# Altium project GPSR_v3.PrjPcb
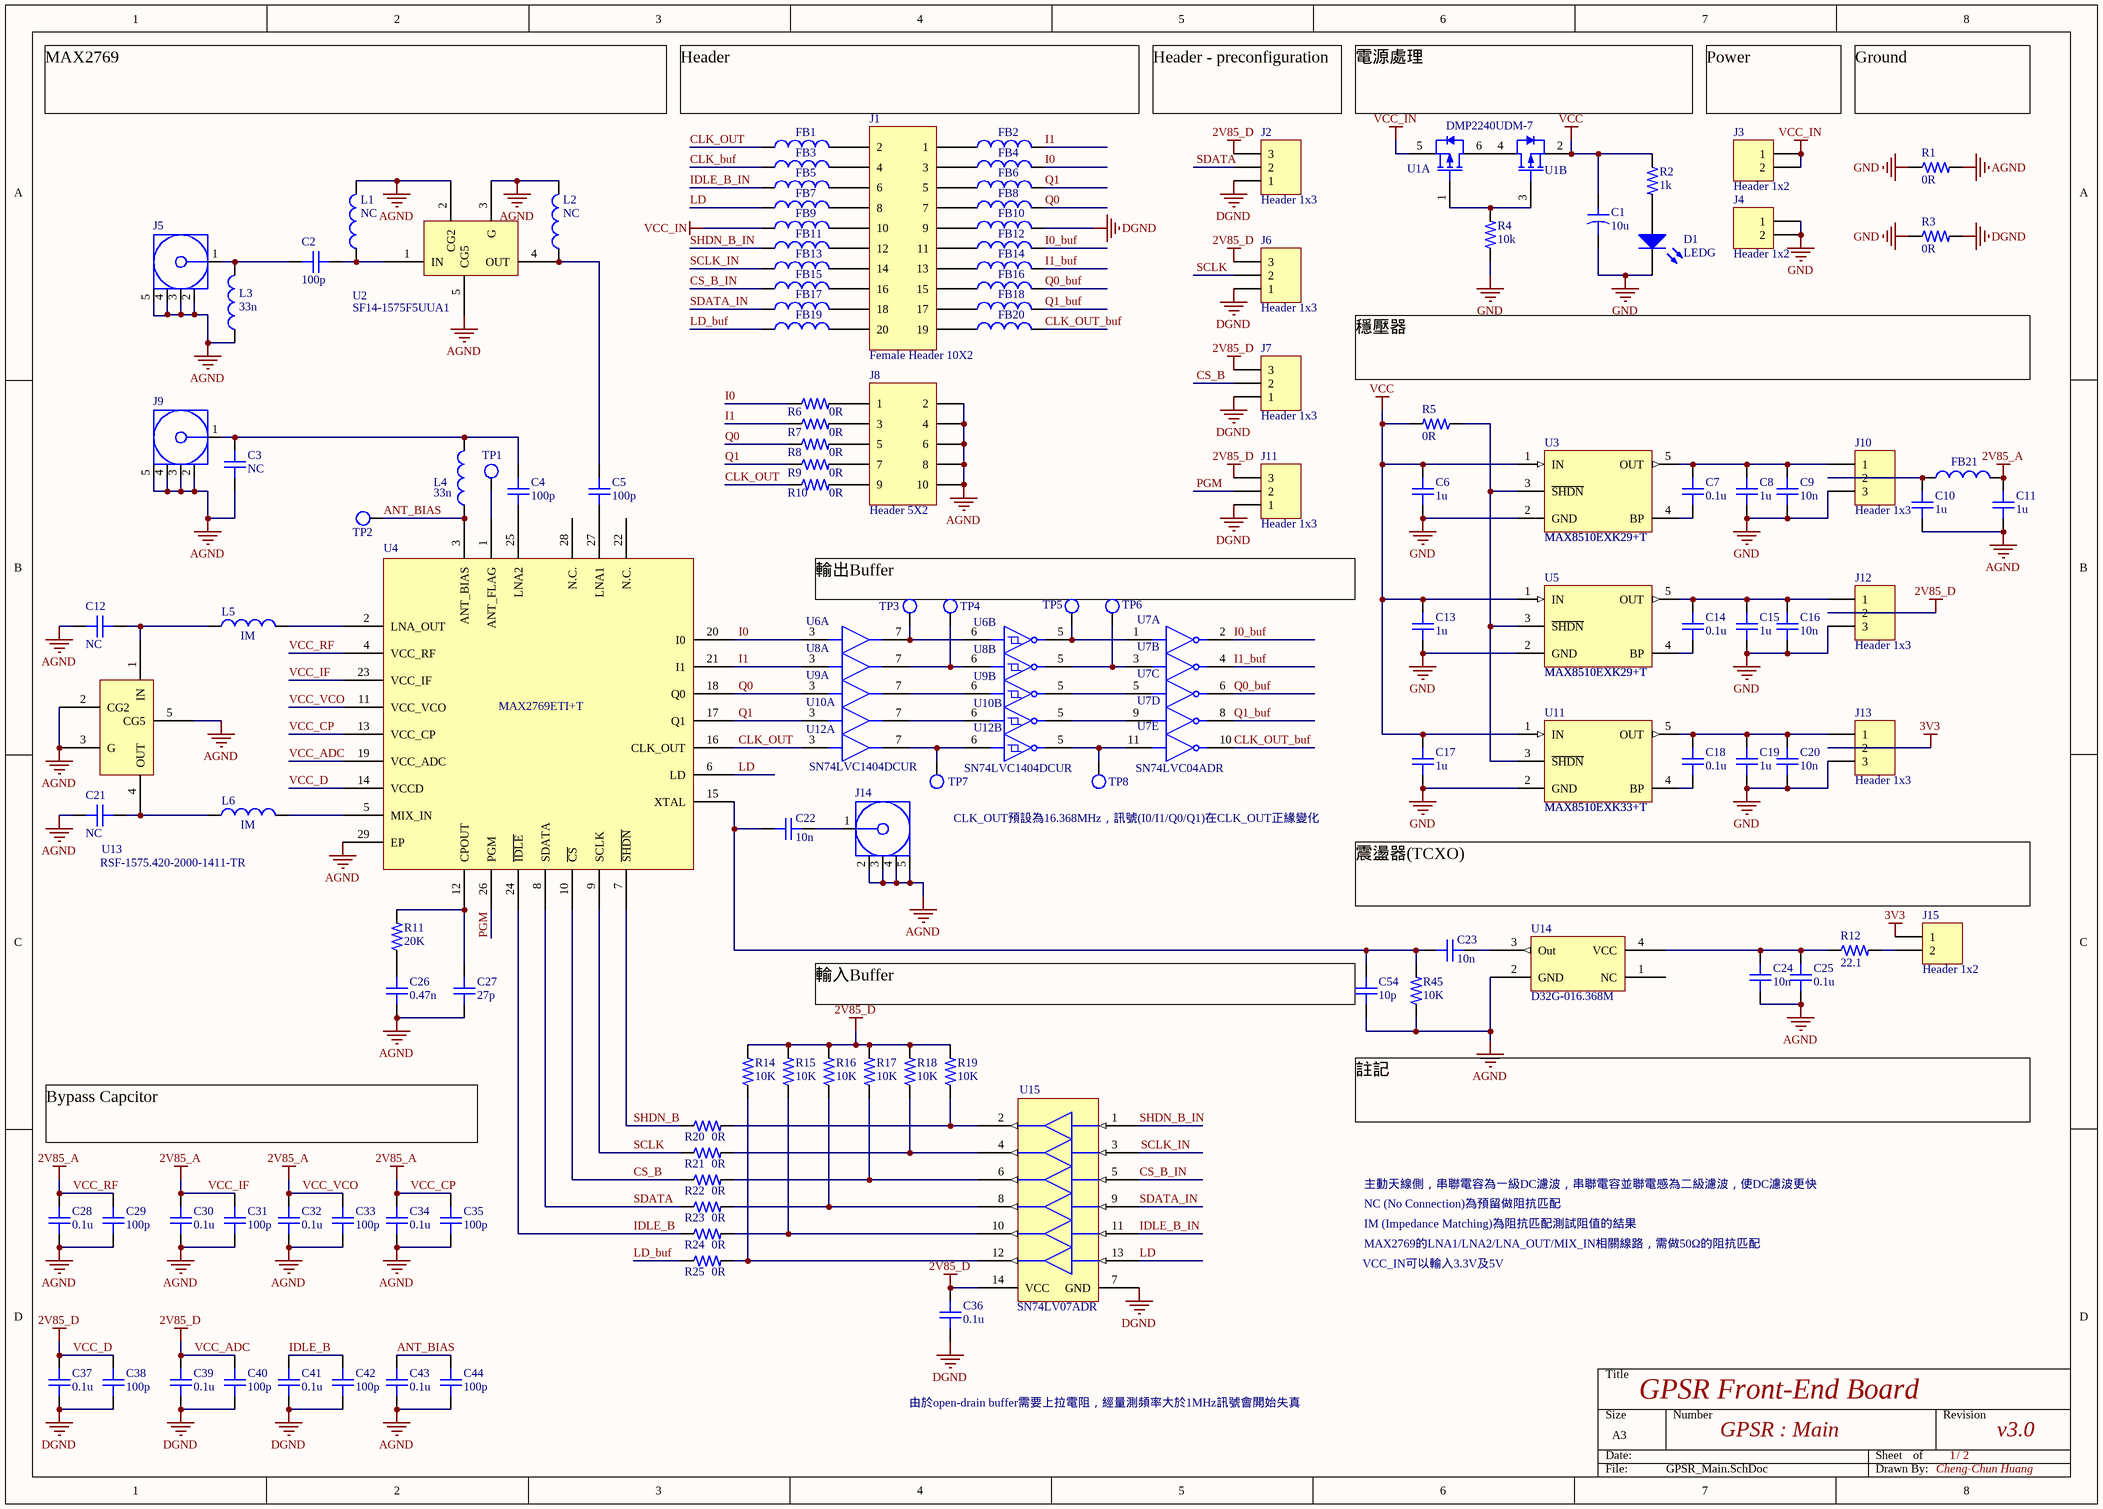
[diagram p0: GPSR_Main.SchDoc]
2 sheets, 185 parts. Net scope: global (net labels, ports and power ports of the same name join across sheets).
Board file: GPSR_v3.PcbDoc
Sheets:
  GPSR_Main.SchDoc
  GPSR_Peripheral.SchDoc

## Sheet GPSR_Main.SchDoc: GPSR Front-End Board
size A3; CompanyName: NYCU; DocumentNumber: GPSR : Main; Revision: v3.0; SheetNumber: 1; SheetTotal: 2; RevisionBy: Cheng-Chun Huang

### Parts
C1  value 10u  [CAPPM6032X280N]  (hidden comment: 10uF)
C2  value 100p  [C0402]  (hidden comment: 100pF)
C3  value NC  [C0402]  (hidden comment: No Connection)
C4  value 100p  [C0402]  (hidden comment: 100pF)
C5  value 100p  [C0402]  (hidden comment: 100pF)
C6  value 1u  [C0402]  (hidden comment: 1uF)
C7  value 0.1u  [C0402]  (hidden comment: 0.1uF)
C8  value 1u  [C0402]  (hidden comment: 1uF)
C9  value 10n  [C0402]  (hidden comment: 10nF)
C10  value 1u  [C0402]  (hidden comment: 1uF)
C11  value 1u  [C0402]  (hidden comment: 1uF)
C12  value NC  [C0402]  (hidden comment: No Connection)
C13  value 1u  [C0402]  (hidden comment: 1uF)
C14  value 0.1u  [C0402]  (hidden comment: 0.1uF)
C15  value 1u  [C0402]  (hidden comment: 1uF)
C16  value 10n  [C0402]  (hidden comment: 10nF)
C17  value 1u  [C0402]  (hidden comment: 1uF)
C18  value 0.1u  [C0402]  (hidden comment: 0.1uF)
C19  value 1u  [C0402]  (hidden comment: 1uF)
C20  value 10n  [C0402]  (hidden comment: 10nF)
C21  value NC  [C0402]  (hidden comment: No Connection)
C22  value 10n  [C0402]  (hidden comment: 10nF)
C23  value 10n  [C0402]  (hidden comment: 10nF)
C24  value 10n  [C0402]  (hidden comment: 10nF)
C25  value 0.1u  [C0402]  (hidden comment: 0.1uF)
C26  value 0.47n  [C0402]  (hidden comment: 0.47nF)
C27  value 27p  [C0402]  (hidden comment: 27pF)
C28  value 0.1u  [C0402]  (hidden comment: 0.1uF)
C29  value 100p  [C0402]  (hidden comment: 100pF)
C30  value 0.1u  [C0402]  (hidden comment: 0.1uF)
C31  value 100p  [C0402]  (hidden comment: 100pF)
C32  value 0.1u  [C0402]  (hidden comment: 0.1uF)
C33  value 100p  [C0402]  (hidden comment: 100pF)
C34  value 0.1u  [C0402]  (hidden comment: 0.1uF)
C35  value 100p  [C0402]  (hidden comment: 100pF)
C36  value 0.1u  [C0603]  (hidden comment: 0.1uF)
C37  value 0.1u  [C0402]  (hidden comment: 0.1uF)
C38  value 100p  [C0402]  (hidden comment: 100pF)
C39  value 0.1u  [C0402]  (hidden comment: 0.1uF)
C40  value 100p  [C0402]  (hidden comment: 100pF)
C41  value 0.1u  [C0402]  (hidden comment: 0.1uF)
C42  value 100p  [C0402]  (hidden comment: 100pF)
C43  value 0.1u  [C0402]  (hidden comment: 0.1uF)
C44  value 100p  [C0402]  (hidden comment: 100pF)
C54  value 10p  [C0402]  (hidden comment: 10pF)
D1  value LEDG  [D0603]  (hidden comment: D0603_LEDG)
FB1  FB0402_signal  [FB0402]  (value not drawn)
FB2  FB0402_signal  [FB0402]  (value not drawn)
FB3  FB0402_signal  [FB0402]  (value not drawn)
FB4  FB0402_signal  [FB0402]  (value not drawn)
FB5  FB0402_signal  [FB0402]  (value not drawn)
FB6  FB0402_signal  [FB0402]  (value not drawn)
FB7  FB0402_signal  [FB0402]  (value not drawn)
FB8  FB0402_signal  [FB0402]  (value not drawn)
FB9  FB0402_signal  [FB0402]  (value not drawn)
FB10  FB0402_signal  [FB0402]  (value not drawn)
FB11  FB0402_signal  [FB0402]  (value not drawn)
FB12  FB0402_signal  [FB0402]  (value not drawn)
FB13  FB0402_signal  [FB0402]  (value not drawn)
FB14  FB0402_signal  [FB0402]  (value not drawn)
FB15  FB0402_signal  [FB0402]  (value not drawn)
FB16  FB0402_signal  [FB0402]  (value not drawn)
FB17  FB0402_signal  [FB0402]  (value not drawn)
FB18  FB0402_signal  [FB0402]  (value not drawn)
FB19  FB0402_signal  [FB0402]  (value not drawn)
FB20  FB0402_signal  [FB0402]  (value not drawn)
FB21  FB0402_pwr  [FB0402]  (value not drawn)
J1  Female Header 10X2  [HDR2X10]
J2  Header 1x3  [HDR1X3]
J3  Header 1x2  [HDR1X2]
J4  Header 1x2  [HDR1X2]
J5  SMA Connector  [SMA-JACK]  (value not drawn)
J6  Header 1x3  [HDR1X3]
J7  Header 1x3  [HDR1X3]
J8  Header 5X2  [HDR2X5]
J9  SMA Connector  [SMA-JACK]  (value not drawn)
J10  Header 1x3  [HDR1X3]
J11  Header 1x3  [HDR1X3]
J12  Header 1x3  [HDR1X3]
J13  Header 1x3  [HDR1X3]
J14  SMA Connector  [SMA-JACK]  (value not drawn)
J15  Header 1x2  [HDR1X2]
L1  value NC  [L0402]  (hidden comment: No Connection)
L2  value NC  [L0402]  (hidden comment: No Connection)
L3  value 33n  [L0402]  (hidden comment: 33nH)
L4  value 33n  [L0402]  (hidden comment: 33nH)
L5  value IM  [L0402]  (hidden comment: Impedance Matching)
L6  value IM  [L0402]  (hidden comment: Impedance Matching)
R1  value 0R  [R0805]  (hidden comment: 0Ω)
R2  value 1k  [R0603]  (hidden comment: 1kΩ)
R3  value 0R  [R0805]  (hidden comment: 0Ω)
R4  value 10k  [R0805]  (hidden comment: 10kΩ)
R5  value 0R  [R0805]  (hidden comment: 0Ω)
R6  value 0R  [R0805]  (hidden comment: 0Ω)
R7  value 0R  [R0805]  (hidden comment: 0Ω)
R8  value 0R  [R0805]  (hidden comment: 0Ω)
R9  value 0R  [R0805]  (hidden comment: 0Ω)
R10  value 0R  [R0805]  (hidden comment: 0Ω)
R11  value 20K  [R0402]  (hidden comment: 20kΩ)
R12  value 22.1  [R0402]  (hidden comment: 22.1Ω)
R14  value 10K  [R0402]  (hidden comment: 10kΩ)
R15  value 10K  [R0402]  (hidden comment: 10kΩ)
R16  value 10K  [R0402]  (hidden comment: 10kΩ)
R17  value 10K  [R0402]  (hidden comment: 10kΩ)
R18  value 10K  [R0402]  (hidden comment: 10kΩ)
R19  value 10K  [R0402]  (hidden comment: 10kΩ)
R20  value 0R  [R0805]  (hidden comment: 0Ω)
R21  value 0R  [R0805]  (hidden comment: 0Ω)
R22  value 0R  [R0805]  (hidden comment: 0Ω)
R23  value 0R  [R0805]  (hidden comment: 0Ω)
R24  value 0R  [R0805]  (hidden comment: 0Ω)
R25  value 0R  [R0805]  (hidden comment: 0Ω)
R45  value 10K  [R0402]  (hidden comment: 10kΩ)
TP1  5006  [5115]  (value not drawn)
TP2  5006  [5115]  (value not drawn)
TP3  5006  [5115]  (value not drawn)
TP4  5006  [5115]  (value not drawn)
TP5  5006  [5115]  (value not drawn)
TP6  5006  [5115]  (value not drawn)
TP7  5006  [5115]  (value not drawn)
TP8  5006  [5115]  (value not drawn)
U1  DMP2240UDM-7  [SOT95P285X140-6N]  (parts A,B of 2)
U2  SF14-1575F5UUA1  [5-SMD]
U3  MAX8510EXK29+T  [SOT65P210X110-5N]
U4  MAX2769ETI+T  [QFN50P500X500X80-29N]  (value not drawn)
U5  MAX8510EXK29+T  [SOT65P210X110-5N]
U6  SN74LVC1404DCUR  [SOP50P310X90-8N]  (value not drawn)  (parts A,B of 4)
U7  SN74LVC04ADR  [SOIC127P600X175-14N]  (value not drawn)  (parts A,B,C,D,E of 7)
U8  SN74LVC1404DCUR  [SOP50P310X90-8N]  (value not drawn)  (parts A,B of 4)
U9  SN74LVC1404DCUR  [SOP50P310X90-8N]  (value not drawn)  (parts A,B of 4)
U10  SN74LVC1404DCUR  [SOP50P310X90-8N]  (value not drawn)  (parts A,B of 4)
U11  MAX8510EXK33+T  [SOT65P210X110-5N]
U12  SN74LVC1404DCUR  [SOP50P310X90-8N]  (parts A,B of 4)
U13  RSF-1575.420-2000-1411-TR  [5-SMD]
U14  D32G-016.368M  [OSC-3225-D32G]
U15  SN74LV07ADR  [SOIC127P600X175-14N]

### Nets
3V3: J13.2 J15.1
AGND: C3.1 C10.1 C11.1 C12.2 C21.2 C24.1 C25.1 C26.1 C27.1 C28.1 C29.1 C30.1 C31.1 C32.1 C33.1 C34.1 C35.1 C43.1 C44.1 C54.1 J5.2(GND) J5.3(GND) J5.4(GND) J5.5(GND) J8.2 J8.4 J8.6 J8.8 J8.10 J9.2(GND) J9.3(GND) J9.4(GND) J9.5(GND) J14.2(GND) J14.3(GND) J14.4(GND) J14.5(GND) L1.2 L2.2 L3.1 R1.2 R45.1 U2.2(CG2) U2.3(G) U2.5(CG5) U4.29(EP) U13.2(CG2) U13.3(G) U13.5(CG5) U14.2(GND)
DGND: C36.2 C37.1 C38.1 C39.1 C40.1 C41.1 C42.1 FB10.2 J2.1 J6.1 J7.1 J11.1 R3.2 U15.7(GND)
GND: C1.2 C6.1 C8.1 C9.1 C13.1 C15.1 C16.1 C17.1 C19.1 C20.1 D1.2(K) J4.1 J4.2 J10.3 J12.3 J13.3 R1.1 R3.1 R4.1 U3.2(GND) U5.2(GND) U11.2(GND)
VCC: C1.1 C6.2 C13.2 C17.2 R2.1 R5.2 U1.2(S2) U3.1(IN) U5.1(IN) U11.1(IN)
VCC_ADC: C36.1 C37.2 C38.2 C39.2 C40.2 J2.3 J6.3 J7.3 J11.3 J12.2 R14.2 R15.2 R16.2 R17.2 R18.2 R19.2 U4.14(VCCD) U4.19(VCC_ADC) U15.14(VCC)  [also labelled 2V85_D, VCC_D]
VCC_CP: C11.2 C28.2 C29.2 C30.2 C31.2 C32.2 C33.2 C34.2 C35.2 FB21.2 U4.4(VCC_RF) U4.11(VCC_VCO) U4.13(VCC_CP) U4.23(VCC_IF)  [also labelled 2V85_A, VCC_IF, VCC_RF, VCC_VCO]
VCC_IN: FB9.1 J3.1 J3.2 U1.5(S1)
ANT_BIAS: C43.2 C44.2 L4.1 TP2.1 U4.3(ANT_BIAS)
CLK_buf: FB3.1
CLK_OUT: FB1.1 R10.1 U4.16(CLK_OUT) U12.3(XIN)
CLK_OUT_buf: FB20.2 U7.10(5Y)
CS_B: J7.2 R22.1 U4.10(~{CS})
CS_B_IN: FB15.1 U15.5(3A)
I0: FB4.2 R6.1 U4.20(I0) U6.3(XIN)
I0_buf: FB12.2 U7.2(1Y)
I1: FB2.2 R7.1 U4.21(I1) U8.3(XIN)
I1_buf: FB14.2 U7.4(2Y)
IDLE_B: C41.2 C42.2 R24.1 U4.24(~{IDLE})
IDLE_B_IN: FB5.1 U15.11(5A)
LD: FB7.1 U4.6(LD) U15.13(6A)
LD_buf: FB19.1 R25.1
PGM: J11.2 U4.26(PGM)
Q0: FB8.2 R8.1 U4.18(Q0) U9.3(XIN)
Q0_buf: FB16.2 U7.6(3Y)
Q1: FB6.2 R9.1 U4.17(Q1) U10.3(XIN)
Q1_buf: FB18.2 U7.8(4Y)
SCLK: J6.2 R21.1 U4.9(SCLK)
SCLK_IN: FB13.1 U15.3(2A)
SDATA: J2.2 R23.1 U4.8(SDATA)
SDATA_IN: FB17.1 U15.9(4A)
SHDN_B: R20.1 U4.7(~{SHDN})
SHDN_B_IN: FB11.1 U15.1(1A)
NetC2_1: C2.1 J5.1(Signal) L3.2
NetC2_2: C2.2 L1.1 U2.1(IN)
NetC3_2: C3.2 C4.2 J9.1(Signal) L4.2
NetC4_1: C4.1 U4.25(LNA2)
NetC5_1: C5.1 U4.27(LNA1)
NetC5_2: C5.2 L2.1 U2.4(OUT)
NetC7_1: C7.1 U3.4(BP)
NetC7_2: C7.2 C8.2 C9.2 J10.1 U3.5(OUT)
NetC10_2: C10.2 FB21.1 J10.2
NetC12_1: C12.1 L5.1 U13.1(IN)
NetC14_1: C14.1 U5.4(BP)
NetC14_2: C14.2 C15.2 C16.2 J12.1 U5.5(OUT)
NetC18_1: C18.1 U11.4(BP)
NetC18_2: C18.2 C19.2 C20.2 J13.1 U11.5(OUT)
NetC21_1: C21.1 L6.1 U13.4(OUT)
NetC22_1: C22.1 C23.1 C54.2 R45.2 U4.15(XTAL)
NetC22_2: C22.2 J14.1(Signal)
NetC23_2: C23.2 U14.3(Out)
NetC24_2: C24.2 C25.2 R12.1 U14.4(VCC)
NetC26_2: C26.2 R11.1
NetC27_2: C27.2 R11.2 U4.12(CPOUT)
NetD1_1: D1.1(A) R2.2
NetFB1_2: FB1.2 J1.2
NetFB2_1: FB2.1 J1.1
NetFB3_2: FB3.2 J1.4
NetFB4_1: FB4.1 J1.3
NetFB5_2: FB5.2 J1.6
NetFB6_1: FB6.1 J1.5
NetFB7_2: FB7.2 J1.8
NetFB8_1: FB8.1 J1.7
NetFB9_2: FB9.2 J1.10
NetFB10_1: FB10.1 J1.9
NetFB11_2: FB11.2 J1.12
NetFB12_1: FB12.1 J1.11
NetFB13_2: FB13.2 J1.14
NetFB14_1: FB14.1 J1.13
NetFB15_2: FB15.2 J1.16
NetFB16_1: FB16.1 J1.15
NetFB17_2: FB17.2 J1.18
NetFB18_1: FB18.1 J1.17
NetFB19_2: FB19.2 J1.20
NetFB20_1: FB20.1 J1.19
NetJ8_1: J8.1 R6.2
NetJ8_3: J8.3 R7.2
NetJ8_5: J8.5 R8.2
NetJ8_7: J8.7 R9.2
NetJ8_9: J8.9 R10.2
NetJ15_2: J15.2 R12.2
NetL5_2: L5.2 U4.2(LNA_OUT)
NetL6_2: L6.2 U4.5(MIX_IN)
NetR4_2: R4.2 U1.1(G1) U1.3(G2)
NetR5_1: R5.1 U3.3(~{SHDN}) U5.3(~{SHDN}) U11.3(~{SHDN})
NetR14_1: R14.1 R25.2 U15.12(6Y)
NetR15_1: R15.1 R24.2 U15.10(5Y)
NetR16_1: R16.1 R23.2 U15.8(4Y)
NetR17_1: R17.1 R22.2 U15.6(3Y)
NetR18_1: R18.1 R21.2 U15.4(2Y)
NetR19_1: R19.1 R20.2 U15.2(1Y)
NetTP1_1: TP1.1 U4.1(ANT_FLAG)
NetTP3_1: TP3.1 U6.6(A) U6.7(OSCOUT)
NetTP4_1: TP4.1 U8.6(A) U8.7(OSCOUT)
NetTP5_1: TP5.1 U6.5(Y) U7.1(1A)
NetTP6_1: TP6.1 U7.3(2A) U8.5(Y)
NetTP7_1: TP7.1 U12.6(A) U12.7(OSCOUT)
NetTP8_1: TP8.1 U7.11(5A) U12.5(Y)
NetU1_4: U1.4(D2) U1.6(D1)
NetU7_5: U7.5(3A) U9.5(Y)
NetU7_9: U7.9(4A) U10.5(Y)
NetU9_6: U9.6(A) U9.7(OSCOUT)
NetU10_6: U10.6(A) U10.7(OSCOUT)

Not connected (* = marked no-connect by the designer): U4 22(N.C.) 28(N.C.); U14 1(NC)

### Notes on the sheet
- MAX2769
- Header
- (near J2) Header - preconfiguration
- (near U1) 電源處理
- (near J3) Power
- Ground
- 穩壓器
- 輸出Buffer
- CLK_OUT預設為16.368MHz，訊號(I0/I1/Q0/Q1)在CLK_OUT正緣變化
- 震盪器(TCXO)
- (near C54) 輸入Buffer
- 註記
- Bypass Capcitor
- 主動天線側，串聯電容為一級DC濾波，串聯電容並聯電感為二級濾波，使DC濾波更快
- IM (Impedance Matching)為阻抗匹配測試阻值的結果
- NC (No Connection)為預留做阻抗匹配
- MAX2769的LNA1/LNA2/LNA_OUT/MIX_IN相關線路，需做50Ω的阻抗匹配
- VCC_IN可以輸入3.3V及5V
- 由於open-drain buffer需要上拉電阻，經量測頻率大於1MHz訊號會開始失真
- /

### Library data of the parts
C1 = C2312_10u_TAJC: Tantalum Capacitors - Solid SMD 35volts 10uF 10%; Manufacturer_Name: Kyocera AVX; Manufacturer_Part_Number: TAJC106K035SNJ; ComponentLink1Description: Datasheet Link; ComponentLink1URL: http://datasheets.avx.com/TAJ.pdf; Supplier 1: Mouser; Supplier Part Number 1: 581-TAJC106K035R
C2 C4 C5 C29 C31 C33 C35 C38 C40 C42 C44 = C0402_100p: Capacitor
C3 C12 C21 = C0402_NC: Capacitor
C6 C8 C10 C11 C13 C15 C17 C19 = C0402_1u: Capacitor
C7 C14 C18 C25 C28 C30 C32 C34 C37 C39 C41 C43 = C0402_0.1u: Capacitor
C9 C16 C20 C22-C24 C54 = C0402_10n: Capacitor
C26 = C0402_0.47n: Capacitor
C27 = C0402_27p: Capacitor
C36 = C0603_0.1u: Capacitor
D1 = D0603_LEDG: LED, green
FB1-FB20 = FB0402_signal: Bead, signal; Value: Bead
FB21 = FB0402_pwr: Bead, power; Value: Bead
J1 = Header 10X2: Female Header, 10-Pin, Dual row; LatestRevisionDate: 17-Jul-2002; LatestRevisionNote: Re-released for DXP Platform.; Publisher: Altium Limited
J2 J6 J7 J10-J13 = Header 1x3: Header, 3-Pin; LatestRevisionDate: 17-Jul-2002; LatestRevisionNote: Re-released for DXP Platform.; Publisher: Altium Limited
J3 J4 J15 = Header 1x2: Header, 2-Pin; LatestRevisionDate: 17-Jul-2002; LatestRevisionNote: Re-released for DXP Platform.; Publisher: Altium Limited
J5 J9 J14 = SMA Connector: RF Connectors / Coaxial Connectors SMA Coaxial Straight, 50Ω
J8 = Header 5X2: Header, 5-Pin, Dual row; LatestRevisionDate: 17-Jul-2002; LatestRevisionNote: Re-released for DXP Platform.; Publisher: Altium Limited
L1 L2 = L0402_NC: Inductor
L3 L4 = L0402_33n: Inductor
L5 L6 = L0402_IM: Inductor
R1 R3 R5-R10 R20-R25 = R0805_0R: Resistor
R2 = R0603_1k: Resistor
R4 = R0805_10k: Resistor
R11 = R0402_20K: Resistor
R12 = R0402_22.1: Resistor
R14-R19 R45 = R0402_10K: Resistor
TP1-TP8 = 5006: Test Point; Manufacturer_Name: Keystone Electronics; ComponentLink1Description: Datasheet Link; ComponentLink1URL: https://www.keyelco.com/product-pdf.cfm?p=1315; Supplier 1: Mouser; Supplier Part Number 1: 534-5006; Manufacturer_Part_Number: 5006
U1 = DMP2240UDM-7: MOSFETs Dual P-Channel; Manufacturer_Name: Diodes Incorporated; ComponentLink1Description: Datasheet Link; ComponentLink1URL: https://www.diodes.com//assets/Datasheets/ds31197.pdf; Supplier 1: Mouser; Supplier Part Number 1: 621-DMP2240UDM-7; Manufacturer_Part_Number: DMP2240UDM-7
U2 = SF14-1575F5UUA1: Signal Conditioning SAW FILTER 1575MHz; Manufacturer_Name: KYOCERA AVX; ComponentLink1Description: Datasheet Link; ComponentLink1URL: https://www.mouser.tw/datasheet/2/40/AVX_140127_Connectivity-1158389.pdf; Supplier 1: Mouser; Supplier Part Number 1: 581-SF14-1575F5UUA1; Manufacturer_Part_Number: SF14-1575F5UUA1
U3 U5 = MAX8510EXK29+T: LDO Voltage Regulators Ultra-Low-Noise, High PSRR, Low-Dropout, Vout=2.85V; Manufacturer_Name: Analog Devices / Maxim Integrated; ComponentLink1Description: Datasheet Link; ComponentLink1URL: https://www.mouser.tw/datasheet/2/609/1/MAX8510_MAX8512-3471024.pdf; Supplier 1: Mouser; Supplier Part Number 1: 700-MAX8510EXK29T; Manufacturer_Part_Number: MAX8510EXK29+T
U4 = MAX2769ETI+T: RF Receiver Universal GPS Receiver; Manufacturer_Part_Number: 700-MAX2769ETI+T; ComponentLink1Description: Datasheet Link; ComponentLink1URL: https://www.analog.com/media/en/technical-documentation/data-sheets/MAX2769.pdf; Supplier 1: Mouser; Supplier Part Number 1: 700-MAX2769ETI+T; Manufacturer_Name: MAX2769ETI+T
U6 U8-U10 U12 = SN74LVC1404DCUR: 2-ch, 1.65-V to 5.5-V inverters with Schmitt-Trigger inputs; Manufacturer_Name: Texas Instruments; ComponentLink1Description: Datasheet Link; ComponentLink1URL: http://www.ti.com/lit/gpn/sn74lvc1404; Supplier 1: Mouser; Supplier Part Number 1: 595-SN74LVC1404DCUR; Manufacturer_Part_Number: SN74LVC1404DCUR
U7 = SN74LVC04ADR: Inverters Hex; Manufacturer_Name: Texas Instruments; ComponentLink1Description: Datasheet Link; ComponentLink1URL: http://www.ti.com/lit/gpn/sn74lvc04a; Supplier 1: Mouser; Supplier Part Number 1: 595-SN74LVC04ADR; Manufacturer_Part_Number: SN74LVC04ADR
U11 = MAX8510EXK33+T: LDO Voltage Regulators Ultra-Low-Noise, High PSRR, Low-Dropout, Vout=3.3V; Manufacturer_Name: Analog Devices / Maxim Integrated; ComponentLink1Description: Datasheet Link; ComponentLink1URL: https://www.mouser.tw/datasheet/2/609/1/MAX8510_MAX8512-3471024.pdf; Supplier 1: Mouser; Supplier Part Number 1: 700-MAX8510EXK33T; Manufacturer_Part_Number: MAX8510EXK33+T
U13 = RSF-1575.420-2000-1411-TR: FILTER SAW 1575.42MHZ 5SMD; Manufacturer_Name: Raltron Electronics; ComponentLink1Description: Datasheet Link; ComponentLink1URL: https://www.raltron.com/webproducts/specs/SAW_FILTER/RSF-1575.420-2000-1411-TR.pdf; Supplier 1: Digikey; Supplier Part Number 1: 2151-RSF-1575.420-2000-1411-TR-ND; Manufacturer_Part_Number: RSF-1575.420-2000-1411-TR
U14 = D32G-016.368M: XTAL OSC TCXO 16.3680MHZ SNWV; Manufacturer_Name: Connor Winfield; Supplier 1: Digikey; Supplier Part Number 1: CW660TR-ND; ComponentLink1Description: Datasheet Link; ComponentLink1URL: http://www.conwin.com/datasheets/tx/tx240.pdf; Manufacturer_Part_Number: D32G-016.368M
U15 = SN74LV07ADR: Buffers & Line Drivers Hex w/ HV Output; Manufacturer_Name: Texas Instruments; Supplier 1: Mouser; ComponentLink1Description: Datasheet Link; ComponentLink1URL: https://www.ti.com/lit/gpn/sn74lv07a; Supplier Part Number 1: 595-SN74LV07ADR; Manufacturer_Part_Number: SN74LV07ADR

## Sheet GPSR_Peripheral.SchDoc: GPSR Front-End Board
size A3; CompanyName: NYCU; DocumentNumber: GPSR : Peripheral; Revision: v3.0; SheetNumber: 2; SheetTotal: 2; RevisionBy: Cheng-Chun Huang
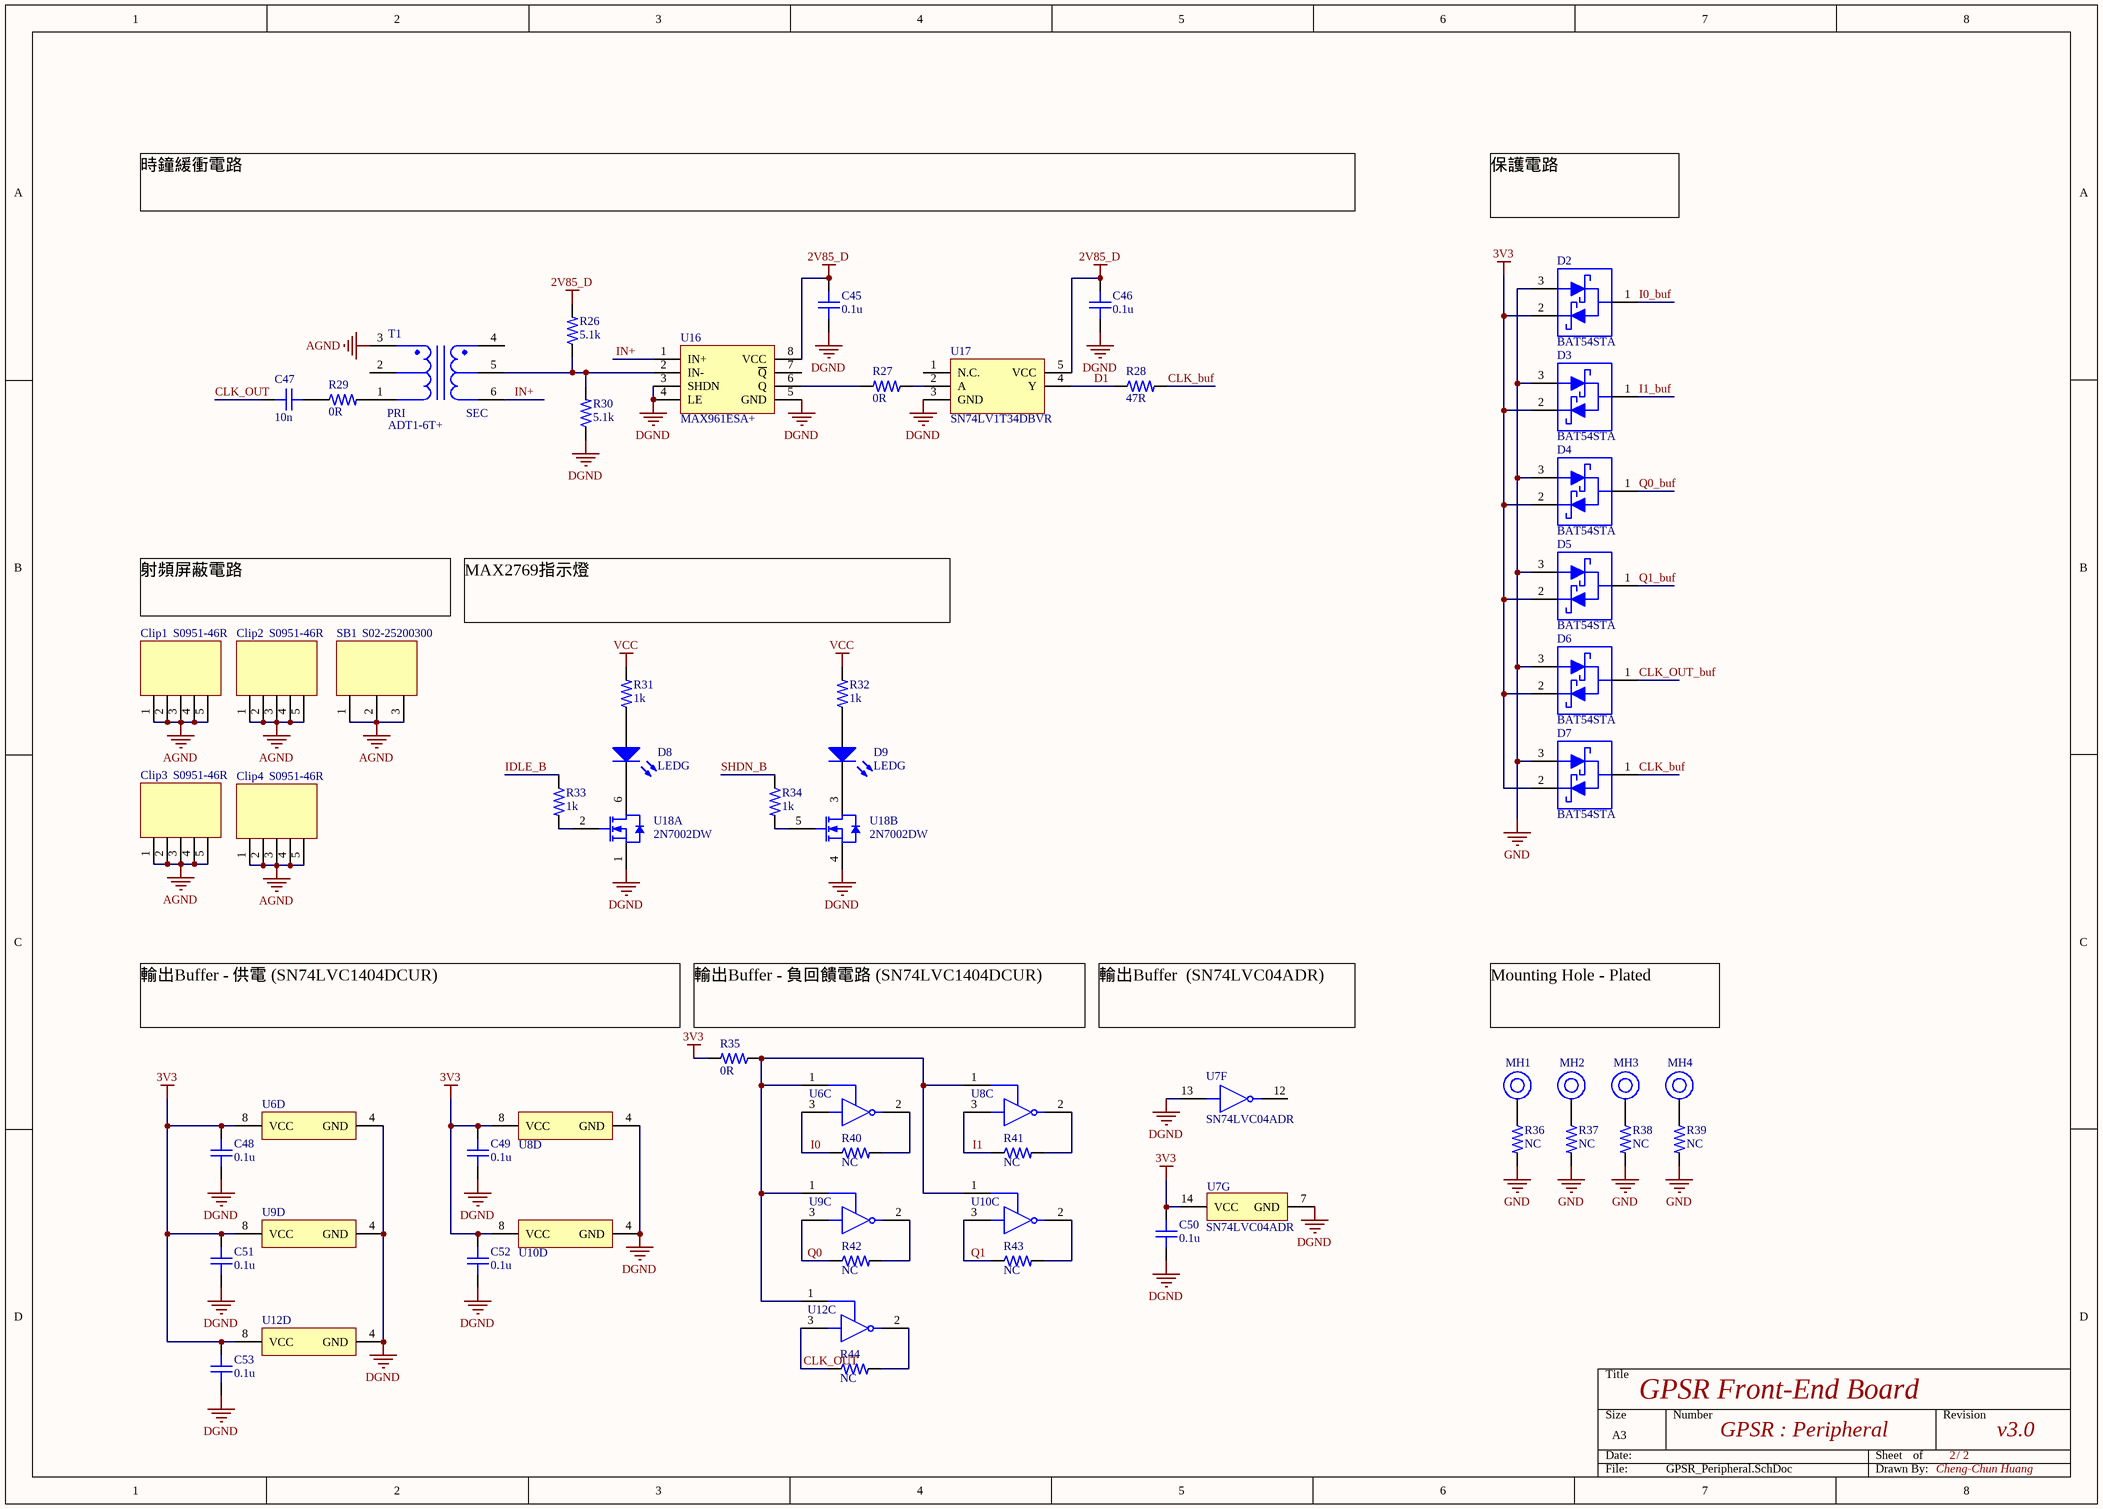
[diagram p1: GPSR_Peripheral.SchDoc]

### Parts
C45  value 0.1u  [C0603]  (hidden comment: 0.1uF)
C46  value 0.1u  [C0603]  (hidden comment: 0.1uF)
C47  value 10n  [C0603]  (hidden comment: 10nF)
C48  value 0.1u  [C0402]  (hidden comment: 0.1uF)
C49  value 0.1u  [C0402]  (hidden comment: 0.1uF)
C50  value 0.1u  [C0402]  (hidden comment: 0.1uF)
C51  value 0.1u  [C0402]  (hidden comment: 0.1uF)
C52  value 0.1u  [C0402]  (hidden comment: 0.1uF)
C53  value 0.1u  [C0402]  (hidden comment: 0.1uF)
Clip1  S0951-46R  [S095146R]
Clip2  S0951-46R  [S095146R]
Clip3  S0951-46R  [S095146R]
Clip4  S0951-46R  [S095146R]
D2  BAT54STA  [SOT96P240X115-3N]
D3  BAT54STA  [SOT96P240X115-3N]
D4  BAT54STA  [SOT96P240X115-3N]
D5  BAT54STA  [SOT96P240X115-3N]
D6  BAT54STA  [SOT96P240X115-3N]
D7  BAT54STA  [SOT96P240X115-3N]
D8  value LEDG  [D0603]  (hidden comment: D0603_LEDG)
D9  value LEDG  [D0603]  (hidden comment: D0603_LEDG)
MH1  MHP3.2mm  [MHP3.2mm]  (value not drawn)
MH2  MHP3.2mm  [MHP3.2mm]  (value not drawn)
MH3  MHP3.2mm  [MHP3.2mm]  (value not drawn)
MH4  MHP3.2mm  [MHP3.2mm]  (value not drawn)
R26  value 5.1k  [R0805]  (hidden comment: 5.1kΩ)
R27  value 0R  [R0805]  (hidden comment: 0Ω)
R28  value 47R  [R0805]  (hidden comment: 47Ω)
R29  value 0R  [R0805]  (hidden comment: 0Ω)
R30  value 5.1k  [R0805]  (hidden comment: 5.1kΩ)
R31  value 1k  [R0603]  (hidden comment: 1kΩ)
R32  value 1k  [R0603]  (hidden comment: 1kΩ)
R33  value 1k  [R0603]  (hidden comment: 1kΩ)
R34  value 1k  [R0603]  (hidden comment: 1kΩ)
R35  value 0R  [R0805]  (hidden comment: 0Ω)
R36  value NC  [R0805]  (hidden comment: No Connection)
R37  value NC  [R0805]  (hidden comment: No Connection)
R38  value NC  [R0805]  (hidden comment: No Connection)
R39  value NC  [R0805]  (hidden comment: No Connection)
R40  value NC  [R0805]  (hidden comment: No Connection)
R41  value NC  [R0805]  (hidden comment: No Connection)
R42  value NC  [R0805]  (hidden comment: No Connection)
R43  value NC  [R0805]  (hidden comment: No Connection)
R44  value NC  [R0805]  (hidden comment: No Connection)
SB1  S02-25200300  [S02-25200300]
T1  ADT1-6T+  [ADT16T]
U6  SN74LVC1404DCUR  [SOP50P310X90-8N]  (value not drawn)  (parts C,D of 4)
U7  SN74LVC04ADR  [SOIC127P600X175-14N]  (parts F,G of 7)
U8  SN74LVC1404DCUR  [SOP50P310X90-8N]  (value not drawn)  (parts C,D of 4)
U9  SN74LVC1404DCUR  [SOP50P310X90-8N]  (value not drawn)  (parts C,D of 4)
U10  SN74LVC1404DCUR  [SOP50P310X90-8N]  (value not drawn)  (parts C,D of 4)
U12  SN74LVC1404DCUR  [SOP50P310X90-8N]  (value not drawn)  (parts C,D of 4)
U16  MAX961ESA+  [SOIC127P600X175-8N]
U17  SN74LV1T34DBVR  [SOT95P280X145-5N]
U18  2N7002DW  [SOT65P210X110-6N]  (parts A,B of 2)

### Nets
2V85_D: C45.2 C46.2 R26.2 U16.8(VCC) U17.5(VCC)  [project net VCC_ADC]
3V3: C48.1 C49.1 C50.1 C51.1 C52.1 C53.1 D2.2(K) D3.2(K) D4.2(K) D5.2(K) D6.2(K) D7.2(K) R35.2 U6.8(VCC) U7.14(VCC) U8.8(VCC) U9.8(VCC) U10.8(VCC) U12.8(VCC)
AGND: Clip1.1 Clip1.2 Clip1.3 Clip1.4 Clip1.5 Clip2.1 Clip2.2 Clip2.3 Clip2.4 Clip2.5 Clip3.1 Clip3.2 Clip3.3 Clip3.4 Clip3.5 Clip4.1 Clip4.2 Clip4.3 Clip4.4 Clip4.5 SB1.1 SB1.2 SB1.3 T1.3(PRIMARY_DOT)
DGND: C45.1 C46.1 C48.2 C49.2 C50.2 C51.2 C52.2 C53.2 R30.1 U6.4(GND) U7.7(GND) U7.13(6A) U8.4(GND) U9.4(GND) U10.4(GND) U12.4(GND) U16.3(SHDN) U16.4(LE) U16.5(GND) U17.3(GND) U18.1(S1) U18.4(S2)
GND: D2.3(A) D3.3(A) D4.3(A) D5.3(A) D6.3(A) D7.3(A) R36.2 R37.2 R38.2 R39.2
VCC: R31.2 R32.2
CLK_buf: D7.1(K/A) R28.2
CLK_OUT: C47.1 R44.1 U12.3(XIN)
CLK_OUT_buf: D6.1(K/A)
D1: R28.1 U17.4(Y)
I0: R40.1 U6.3(XIN)
I0_buf: D2.1(K/A)
I1: R41.1 U8.3(XIN)
I1_buf: D3.1(K/A)
IDLE_B: R33.1
IN+: T1.6(SECONDARY) U16.1(IN+)
Q0: R42.1 U9.3(XIN)
Q0_buf: D4.1(K/A)
Q1: R43.1 U10.3(XIN)
Q1_buf: D5.1(K/A)
SHDN_B: R34.1
NetC47_2: C47.2 R29.1
NetD8_1: D8.1(A) R31.1
NetD8_2: D8.2(K) U18.6(D1)
NetD9_1: D9.1(A) R32.1
NetD9_2: D9.2(K) U18.3(D2)
NetMH1_1: MH1.1 R36.1
NetMH2_1: MH2.1 R37.1
NetMH3_1: MH3.1 R38.1
NetMH4_1: MH4.1 R39.1
NetR26_1: R26.1 R30.2 T1.5(SECONARY_CT) U16.2(IN-)
NetR27_1: R27.1 U17.2(A)
NetR27_2: R27.2 U16.6(Q)
NetR29_2: R29.2 T1.1(PRIMARY)
NetR33_2: R33.2 U18.2(G1)
NetR34_2: R34.2 U18.5(G2)
NetR35_1: R35.1 U6.1(CTRL) U8.1(CTRL) U9.1(CTRL) U10.1(CTRL) U12.1(CTRL)
NetR40_2: R40.2 U6.2(XOUT)
NetR41_2: R41.2 U8.2(XOUT)
NetR42_2: R42.2 U9.2(XOUT)
NetR43_2: R43.2 U10.2(XOUT)
NetR44_2: R44.2 U12.2(XOUT)

Not connected (* = marked no-connect by the designer): T1 2(NOT_USED) 4(SECONDARY_DOT); U7 12(6Y); U16 7(~{Q}); U17 1(N.C.)

### Notes on the sheet
- 時鐘緩衝電路
- 保護電路
- 射頻屏蔽電路
- MAX2769指示燈
- (near R35) 輸出Buffer - 供電 (SN74LVC1404DCUR)
- (near R35) 輸出Buffer - 負回饋電路 (SN74LVC1404DCUR)
- 輸出Buffer  (SN74LVC04ADR)
- Mounting Hole - Plated
- /
- (in symbol ADT1-6T+) PRI; SEC

### Library data of the parts
C45 C46 = C0603_0.1u: Capacitor
C47 = C0603_10n: Capacitor
C48-C53 = C0402_0.1u: Capacitor
Clip1-Clip4 = S0951-46R: EMI Gaskets, Sheets, Absorbers & Shielding EMC Shield Can Clip 0.20MM Thick Cans; Manufacturer_Name: Harwin; ComponentLink1Description: Datasheet Link; ComponentLink1URL: https://componentsearchengine.com/Datasheets/2/S0951-46R.pdf; Supplier 1: Mouser; Supplier Part Number 1: 855-S0951-46R; Manufacturer_Part_Number: S0951-46R
D2-D7 = BAT54STA: Schottky Diodes & Rectifiers Series 30V 200mA; Manufacturer_Name: Diodes Incorporated; Manufacturer_Part_Number: BAT54STA; Supplier 1: Mouser; ComponentLink1Description: Datasheet Link; ComponentLink1URL: https://www.mouser.tw/datasheet/2/115/DIODS12182_1-2541735.pdf; Supplier Part Number 1: 522-BAT54STA
D8 D9 = D0603_LEDG: LED, green
MH1-MH4 = MHP3.2mm: Mounting Hole Plated 3.2mm
R26 R30 = R0805_5.1k: Resistor
R27 R29 R35 = R0805_0R: Resistor
R28 = R0805_47R: Resistor
R31-R34 = R0603_1k: Resistor
R36-R44 = R0805_NC: Resistor
SB1 = S02-25200300: EMI Gaskets, Sheets, Absorbers & Shielding EMC Shield Can .2mm thick, 25X20X03; Manufacturer_Name: Harwin; ComponentLink1Description: Datasheet Link; ComponentLink1URL: https://www.mouser.tw/datasheet/2/181/S02_XXXXXXX0-1273990.pdf; Supplier 1: Mouser; Supplier Part Number 1: 855-S02-25200300; Manufacturer_Part_Number: S02-25200300
T1 = ADT1-6T+: Audio Transformers / Signal Transformers RF XFMR / SURF MOUNT / RoHS; Manufacturer_Name: Mini-Circuits; Manufacturer_Part_Number: ADT1-6T+; ComponentLink1Description: Datasheet Link; ComponentLink1URL: https://www.mouser.tw/datasheet/2/1030/ADT1-6T_2b-1700294.pdf; Supplier 1: Mouser; Supplier Part Number 1: 139-ADT1-6T
U6 U8-U10 U12 = SN74LVC1404DCUR: as U6 on sheet GPSR_Main; ComponentLink1Description: Datasheet Link; ComponentLink1URL: http://www.ti.com/lit/gpn/sn74lvc1404; Supplier 1: Mouser; Supplier Part Number 1: 595-SN74LVC1404DCUR; Manufacturer_Part_Number: SN74LVC1404DCUR
U7 = SN74LVC04ADR: as U7 on sheet GPSR_Main; ComponentLink1Description: Datasheet Link; ComponentLink1URL: http://www.ti.com/lit/gpn/sn74lvc04a; Supplier 1: Mouser; Supplier Part Number 1: 595-SN74LVC04ADR; Manufacturer_Part_Number: SN74LVC04ADR
U16 = MAX961ESA+: Analog Comparators Single/Dual/Quad, Ultra-High-Speed, +3V; Manufacturer_Name: Analog Devices / Maxim Integrated; Manufacturer_Part_Number: MAX961ESA+; ComponentLink1Description: Datasheet Link; ComponentLink1URL: http://datasheets.maximintegrated.com/en/ds/MAX961-MAX999.pdf; Supplier 1: Mouser; Supplier Part Number 1: 700-MAX961ESA
U17 = SN74LV1T34DBVR: Translation - Voltage Levels SGL Pwr Spply Buffer GATE CMOS; Manufacturer_Name: Texas Instruments; ComponentLink1Description: Datasheet Link; ComponentLink1URL: http://www.ti.com/lit/gpn/sn74lv1t34; Supplier 1: Mouser; Supplier Part Number 1: 595-SN74LV1T34DBVR; Manufacturer_Part_Number: SN74LV1T34DBVR
U18 = 2N7002DW: MOSFETs N-Chan Enhancement Mode Field Effect; Manufacturer_Name: onsemi; ComponentLink1Description: Datasheet Link; ComponentLink1URL: https://datasheet.datasheetarchive.com/originals/distributors/Datasheets_SAMA/951ecc1ab16cbf3d5524c3c8fb4b034a.pdf; Supplier 1: Mouser; Supplier Part Number 1: 512-2N7002W; Manufacturer_Part_Number: 2N7002DW

## Nets that join several sheets
3V3: GPSR_Main (J13.2 J15.1), GPSR_Peripheral (19 pins)
AGND: GPSR_Main (50 pins), GPSR_Peripheral (24 pins)
DGND: GPSR_Main (14 pins), GPSR_Peripheral (22 pins)
GND: GPSR_Main (22 pins), GPSR_Peripheral (10 pins)
VCC: GPSR_Main (10 pins), GPSR_Peripheral (R31.2 R32.2)
VCC_ADC: GPSR_Main (19 pins), GPSR_Peripheral (5 pins)
CLK_buf: GPSR_Main (FB3.1), GPSR_Peripheral (D7.1 R28.2)
CLK_OUT: GPSR_Main (FB1.1 R10.1 U4.16 U12.3), GPSR_Peripheral (C47.1 R44.1 U12.3)
CLK_OUT_buf: GPSR_Main (FB20.2 U7.10), GPSR_Peripheral (D6.1)
I0: GPSR_Main (FB4.2 R6.1 U4.20 U6.3), GPSR_Peripheral (R40.1 U6.3)
I0_buf: GPSR_Main (FB12.2 U7.2), GPSR_Peripheral (D2.1)
I1: GPSR_Main (FB2.2 R7.1 U4.21 U8.3), GPSR_Peripheral (R41.1 U8.3)
I1_buf: GPSR_Main (FB14.2 U7.4), GPSR_Peripheral (D3.1)
IDLE_B: GPSR_Main (C41.2 C42.2 R24.1 U4.24), GPSR_Peripheral (R33.1)
Q0: GPSR_Main (FB8.2 R8.1 U4.18 U9.3), GPSR_Peripheral (R42.1 U9.3)
Q0_buf: GPSR_Main (FB16.2 U7.6), GPSR_Peripheral (D4.1)
Q1: GPSR_Main (FB6.2 R9.1 U4.17 U10.3), GPSR_Peripheral (R43.1 U10.3)
Q1_buf: GPSR_Main (FB18.2 U7.8), GPSR_Peripheral (D5.1)
SHDN_B: GPSR_Main (R20.1 U4.7), GPSR_Peripheral (R34.1)